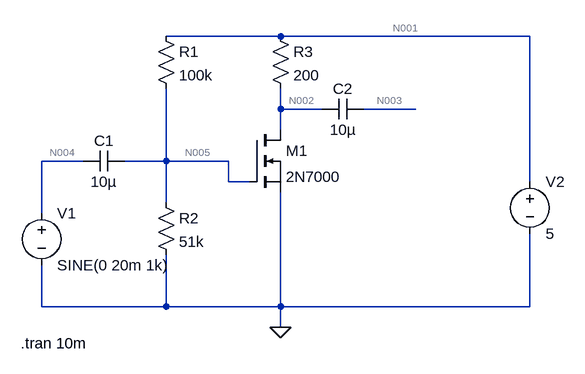
[diagram p0: schematic second.asc]
second.asc, the LTspice schematic file:
Version 4
SHEET 1 880 680
WIRE 320 -80 144 -80
WIRE 704 -80 320 -80
WIRE 320 32 320 0
WIRE 384 32 320 32
WIRE 528 32 448 32
WIRE 320 64 320 32
WIRE 16 112 -48 112
WIRE 144 112 144 0
WIRE 144 112 80 112
WIRE 240 112 144 112
WIRE 240 144 240 112
WIRE 272 144 240 144
WIRE 704 144 704 -80
WIRE 144 176 144 112
WIRE -48 192 -48 112
WIRE -48 336 -48 272
WIRE 144 336 144 256
WIRE 144 336 -48 336
WIRE 320 336 320 160
WIRE 320 336 144 336
WIRE 704 336 704 224
WIRE 704 336 320 336
WIRE 320 368 320 336
FLAG 320 368 0
SYMBOL voltage -48 176 R0
WINDOW 123 0 0 Left 2
WINDOW 39 0 0 Left 2
SYMATTR InstName V1
SYMATTR Value SINE(0 20m 1k)
SYMBOL res 128 -96 R0
SYMATTR InstName R1
SYMATTR Value 100k
SYMBOL res 304 -96 R0
SYMATTR InstName R3
SYMATTR Value 200
SYMBOL res 128 160 R0
SYMATTR InstName R2
SYMATTR Value 51k
SYMBOL cap 80 96 R90
WINDOW 0 0 32 VBottom 2
WINDOW 3 32 32 VTop 2
SYMATTR InstName C1
SYMATTR Value 10µ
SYMBOL cap 448 16 R90
WINDOW 0 0 32 VBottom 2
WINDOW 3 32 32 VTop 2
SYMATTR InstName C2
SYMATTR Value 10µ
SYMBOL voltage 704 128 R0
WINDOW 123 0 0 Left 2
WINDOW 39 0 0 Left 2
SYMATTR InstName V2
SYMATTR Value 5
SYMBOL nmos 272 64 R0
SYMATTR InstName M1
SYMATTR Value 2N7000
TEXT -80 392 Left 2 !.tran 10m

The netlist it stands for:
* second.asc
V1 N004 0 SINE(0 20m 1k)
R1 N001 N005 100k
R3 N001 N002 200
R2 N005 0 51k
C1 N005 N004 10µ
C2 N003 N002 10µ
V2 N001 0 5
M1 N002 N005 0 0 2N7000
.model NMOS NMOS
.model PMOS PMOS
.lib standard.mos
.tran 10m
.backanno
.end

* Results of the author's LTspice run, read from the files saved beside the schematic
* Operating Point, zero values left out:
*   V(n001) = 5 V
*   V(n005) = 1.689 V
*   V(n002) = 4.868 V
*   V(n003) = 48.68 µV
*   Id(M1) = 661.9 µA
*   Is(M1) = -661.9 µA
*   I(R2) = 33.11 µA
*   I(R3) = 661.9 µA
*   I(R1) = 33.11 µA
*   I(V2) = -695 µA
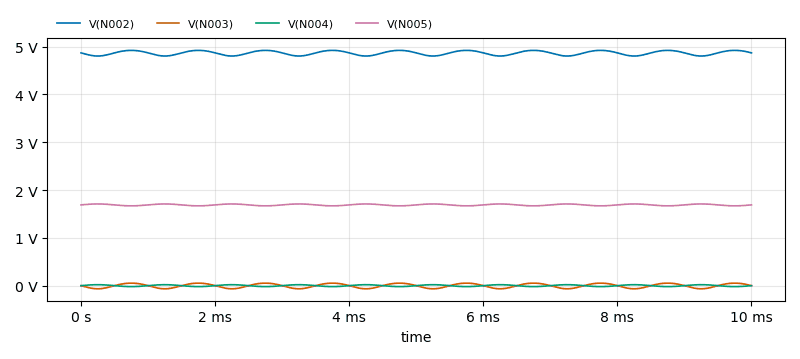
[diagram p1: Transient Analysis of second.asc, plotted from the saved traces]
* Transient Analysis, 1 run:
*   V(N002): min 4.802 V, max 4.92 V, average 4.864 V, rms 4.865 V, last 4.868 V
*   V(N003): min -65.74 mV, max 52.75 mV, average -3.209 mV, rms 42.1 mV, last 51.56 µV
*   V(N004): min -19.97 mV, max 19.98 mV, average -845.4 nV, rms 14.13 mV, last 0 V
*   V(N005): min 1.669 V, max 1.709 V, average 1.689 V, rms 1.689 V, last 1.689 V